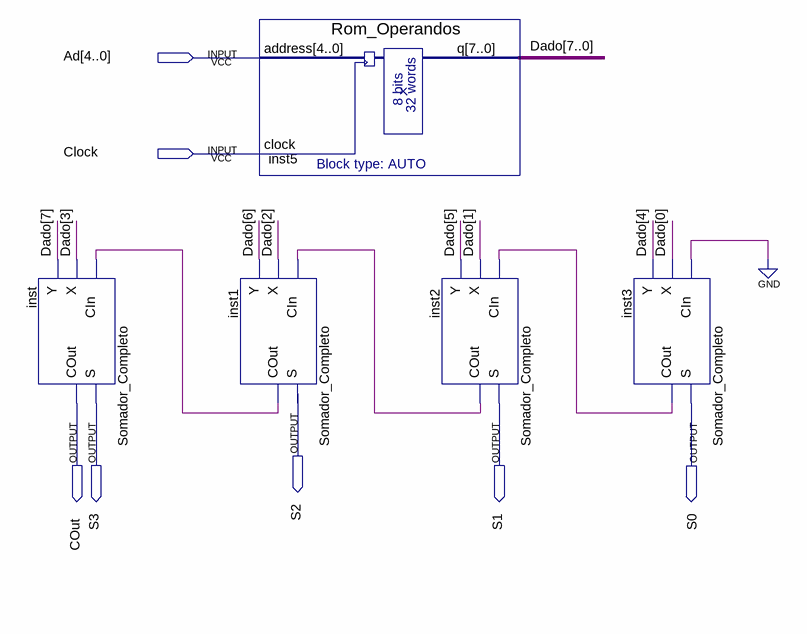
[diagram p0: schematic sheet]
// Quartus schematic Somador_4_Bits.bdf as structural Verilog: 5 symbols, 7 pins
module Somador_4_Bits (
  input  [4:0] Ad,
  input  Clock,
  output S2,
  output COut,
  output S3,
  output S1,
  output S0
);

  wire inst1_cout, inst2_cout, inst3_cout;
  wire [7:0] Dado;

  Somador_Completo inst (.CIn(inst1_cout), .X(Dado[3]), .Y(Dado[7]), .S(S3), .COut(COut));
  Somador_Completo inst1 (.CIn(inst2_cout), .X(Dado[2]), .Y(Dado[6]), .COut(inst1_cout));  // open: S
  Rom_Operandos inst5 (.address(Ad), .clock(Clock), .q(Dado));
  Somador_Completo inst2 (.CIn(inst3_cout), .X(Dado[1]), .Y(Dado[5]), .S(S1), .COut(inst2_cout));
  Somador_Completo inst3 (.CIn(1'b0), .X(Dado[0]), .Y(Dado[4]), .S(S0), .COut(inst3_cout));
endmodule
